# EAGLE design untitled (EAGLE 9.6.2)
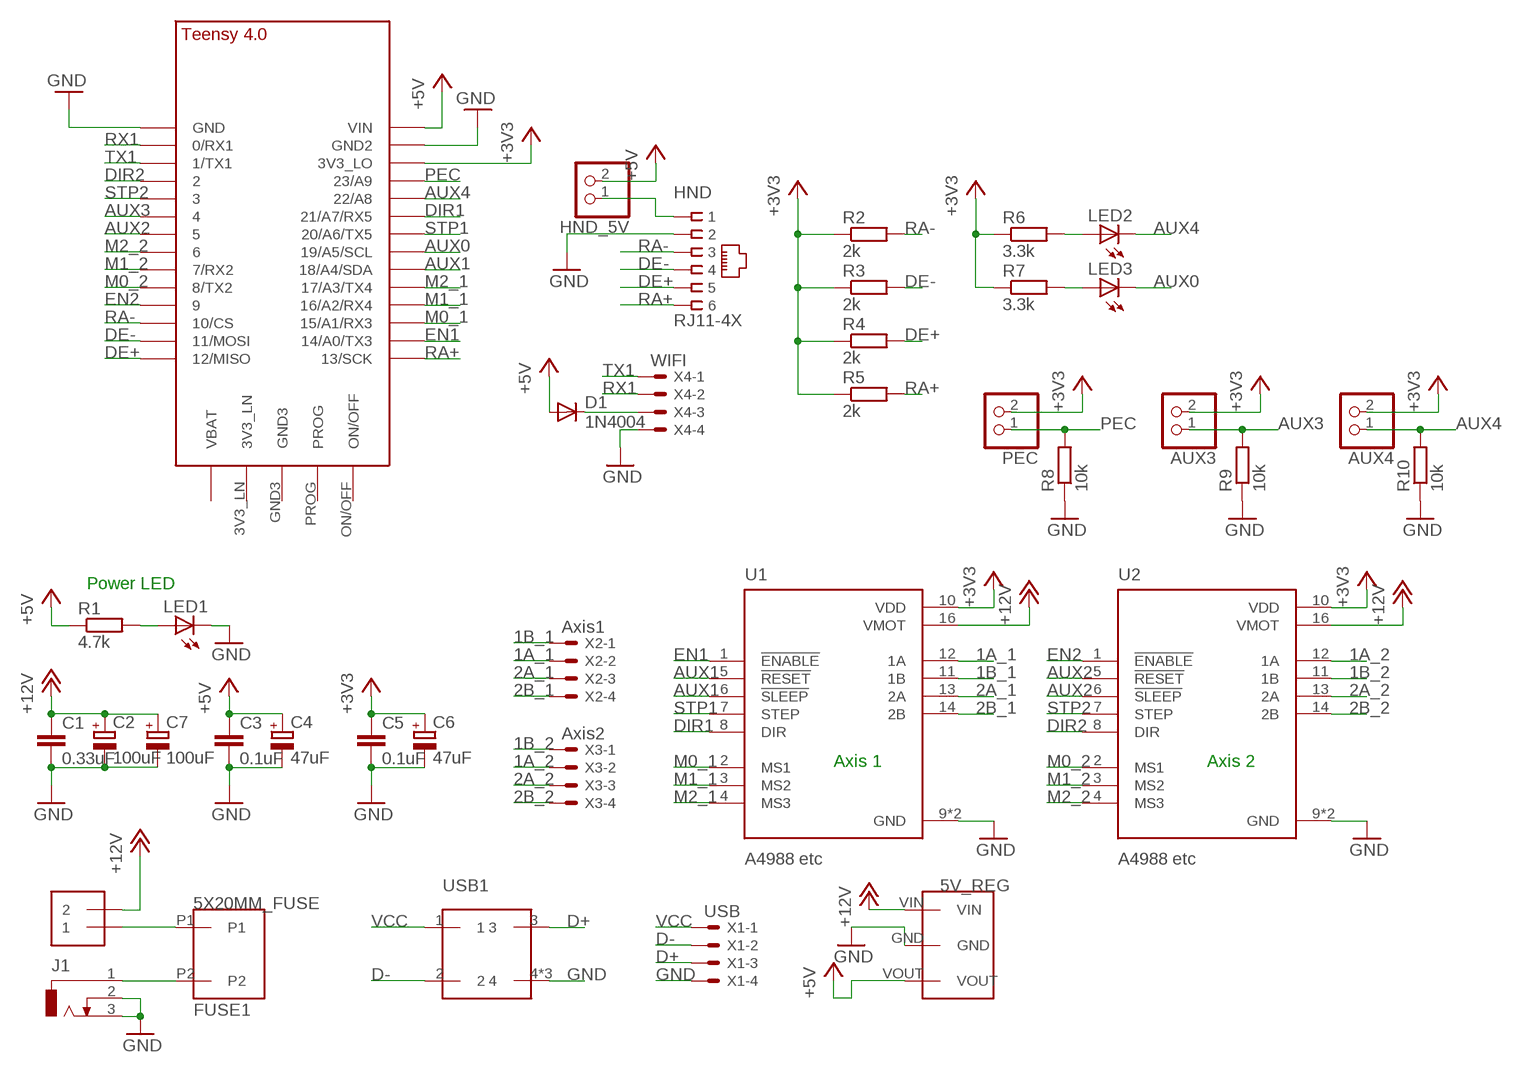
[diagram p0: schematic, sheet 1]

## Parts
5V_REG  TSR_5V  [TSR_5V]
AUX3  PINHD-1X2  [1X02]
AUX4  PINHD-1X2  [1X02]
C1  0.33uF  C-EU050-024X044  [C050-024X044]
C2  100uF  CPOL-EUE5-8.5  [E5-8,5]
C3  0.1uF  C-EU050-024X044  [C050-024X044]
C4  47uF  CPOL-EUE5-8.5  [E5-8,5]
C5  0.1uF  C-EU050-024X044  [C050-024X044]
C6  47uF  CPOL-EUE5-8.5  [E5-8,5]
C7  100uF  CPOL-EUE5-8.5  [E5-8,5]
D1  1N4004  [DO41-10]
FUSE1  5X20MM_FUSE  [5X20MM_FUSE]
HND  RJ11-4X  [RJ11-NO_SHIELD]
HND_5V  PINHD-1X2  [1X02]
J1  DCJ0303  [DCJ0303]
LED1  LED5MM  [LED5MM]
LED2  LED5MM  [LED5MM]
LED3  LED5MM  [LED5MM]
PEC  PINHD-1X2  [1X02]
R1  4.7k  R-EU_0207/7  [0207/7]
R2  2k  R-EU_0207/7  [0207/7]
R3  2k  R-EU_0207/7  [0207/7]
R4  2k  R-EU_0207/7  [0207/7]
R5  2k  R-EU_0207/7  [0207/7]
R6  3.3k  R-EU_0207/7  [0207/7]
R7  3.3k  R-EU_0207/7  [0207/7]
R8  10k  R-EU_0207/7  [0207/7]
R9  10k  R-EU_0207/7  [0207/7]
R10  10k  R-EU_0207/7  [0207/7]
SWITCH  1X2-3.5MM  [1X2-3.5MM]
U1  A4988 etc  A4988_STEPPER_MOTOR_DRIVER_CARRIER  [MODULE_A4988_STEPPER_MOTOR_DRIVER_CARRIER]
U2  A4988 etc  A4988_STEPPER_MOTOR_DRIVER_CARRIER  [MODULE_A4988_STEPPER_MOTOR_DRIVER_CARRIER]
U$1  TEENSY_4.0  [TEENSY_4.0]
USB1  USB-B_SOCKET  [USB-B_SOCKET]
X1  USB  JST-XH-04-PIN-ROUND-PAD  [JST-XH-04-PACKAGE-ROUND-PAD]
X2  Axis1  JST-XH-04-PIN-LONG-PAD  [JST-XH-04-PACKAGE-LONG-PAD]
X3  Axis2  JST-XH-04-PIN-LONG-PAD  [JST-XH-04-PACKAGE-LONG-PAD]
X4  WIFI  JST-XH-04-PIN-LONG-PAD  [JST-XH-04-PACKAGE-LONG-PAD]

## Nets
1A_1: U1.12(1A) X2.2
1A_2: U2.12(1A) X3.2
1B_1: U1.11(1B) X2.1
1B_2: U2.11(1B) X3.1
2A_1: U1.13(2A) X2.3
2A_2: U2.13(2A) X3.3
2B_1: U1.14(2B) X2.4
2B_2: U2.14(2B) X3.4
+3V3: AUX3.2 AUX4.2 C5.1 C6.+ PEC.2 R2.1 R3.1 R4.1 R5.1 R6.1 R7.1 U1.10(VDD) U2.10(VDD) U$1.3V3_LO
+5V: 5V_REG.VOUT C3.1 C4.+ D1.A HND_5V.2 R1.1 U$1.VIN
+12V: 5V_REG.VIN C1.1 C2.+ C7.+ SWITCH.2 U1.16(VMOT) U2.16(VMOT)
AUX0: LED3.K(C) U$1.19/A5/SCL
AUX1: U1.5(!RESET) U1.6(!SLEEP) U$1.18/A4/SDA
AUX2: U2.5(!RESET) U2.6(!SLEEP) U$1.5
AUX3: AUX3.1 R9.2 U$1.4/CANRX
AUX4: AUX4.1 LED2.K(C) R10.2 U$1.22/A8
D+: USB1.3 X1.3
D-: USB1.2 X1.2
DE+: HND.5 R4.2 U$1.12/MISO
DE-: HND.4 R3.2 U$1.11/MOSI
DIR1: U1.8(DIR) U$1.21/A7(21/A7/RX5)
DIR2: U2.8(DIR) U$1.2
EN1: U1.1(!ENABLE) U$1.14/A0(14/A0/TX3)
EN2: U2.1(!ENABLE) U$1.9/CS
GND: 5V_REG.GND C1.2 C2.- C3.2 C4.- C5.2 C6.- C7.- HND.2 J1.2 J1.3 LED1.K(C) R8.1 R9.1 R10.1 U1.9(GND) U1.15(GND) U2.9(GND) U2.15(GND) U$1.GND U$1.GND2 USB1.4 USB1.P$1 USB1.P$2 X1.4 X4.4
M0_1: U1.2(MS1) U$1.15/A1(15/A1/RX3)
M0_2: U2.2(MS1) U$1.8(8/TX2)
M1_1: U1.3(MS2) U$1.16/A2(16/A2/RX4)
M1_2: U2.3(MS2) U$1.7(7/RX2)
M2_1: U1.4(MS3) U$1.17/A3(17/A3/TX4)
M2_2: U2.4(MS3) U$1.6
N$1: FUSE1.P2 J1.1
N$2: FUSE1.P1 SWITCH.1
N$3: LED1.A R1.2
N$4: D1.C X4.3
N$5: HND.1 HND_5V.1
N$7: LED2.A R6.2
N$8: LED3.A R7.2
PEC: PEC.1 R8.2 U$1.23/A9
RA+: HND.6 R5.2 U$1.13/SCK
RA-: HND.3 R2.2 U$1.10/CS
RX1: U$1.0/RX(0/RX1) X4.2
STP1: U1.7(STEP) U$1.20/A6(20/A6/TX5)
STP2: U2.7(STEP) U$1.3/CANTX
TX1: U$1.1/TX(1/TX1) X4.1
VCC: USB1.1 X1.1
Unconnected: U$1.3V3_LN U$1.GND3 U$1.ON/OFF U$1.PROG U$1.VBAT\(VBAT)

## Notes on the sheet
- Power LED
- Axis 1 | Axis 2

## Library data of the parts
5V_REG = alans_lbr:TSR_5V
AUX3 AUX4 HND_5V PEC = pinhead:PINHD-1X2: PIN HEADER
C1 C3 C5 = rcl:C-EU: CAPACITOR, European symbol; SPICEPREFIX: C
C2 C4 C6 C7 = rcl:CPOL-EU: POLARIZED CAPACITOR, European symbol; SPICEPREFIX: C
D1 = adafruit:1N4004: DIODE General purpose 1N400x type rectifier (With bigger pads) http://www.ladyada.net/library/pcb/eaglelibrary.html
FUSE1 = alans_lbr:5X20MM_FUSE
HND = con-tycoelectronics:RJ11: CORCOM Modular RJ Jacks No Shield Source: www.tycoelectronics.com .. ENG_DS_1654001_1099_RJ_L_0507.pdf; MPN: 6609214-3; OC_FARNELL: unknown; OC_NEWARK: 19R7022
J1 = con-jack:DCJ0303: DC POWER JACK Source: DCJ0303.pdf; OC_FARNELL: unknown; OC_NEWARK: unknown
LED1-LED3 = adafruit:LED: LED OSRAM: - CHIPLED LG R971, LG N971, LY N971, LG Q971, LY Q971, LO R971, LY R971 LH N974, LH R974 LS Q976, LO Q976, LY Q976 LO Q996 - Hyper CHIPLED LW Q18S LB Q993, LB Q99A, LB R99A - SideLED LS A670, LO A670, LY A670, LG A670, LP A670 LB A673, LV A673, LT A673, LW A673 LH A674 LY A675 LS A676, LA A676, LO A676, LY A676, LW A676 LS A679, LY A679, LG A679 - Hyper Micro SIDELED® LS Y876, LA Y876, LO Y876, LY Y876 LT Y87S - SmartLED LW L88C, LW L88S LB L89C, LB L89S, LG L890 LS L89K, LO L89K, LY L89K LS L896, LA L896, LO L896, LY L896 - TOPLED LS T670, LO T670, LY T670, LG T670, LP T670 LSG T670, LSP T670, LSY T670, LOP T670, LYG T670 LG T671, LOG T671, LSG T671 LB T673, LV T673, LT T673, LW T673 LH T674 LS T676, LA T676, LO T676, LY T676, LB T676, LH T676, LSB T676, LW T676 LB T67C, LV T67C, LT T67C, LS T67K, LO T67K, LY T67K, LW E67C LS E67B, LA E67B, LO E67B, LY E67B, LB E67C, LV E67C, LT E67C LW T67C LS T679, LY T679, LG T679 LS T770, LO T770, LY T770, LG T770, LP T770 LB T773, LV T773, LT T773, LW T773 LH T774 LS E675, LA E675, LY E675, LS T675 LS T776, LA T776, LO T776, LY T776, LB T776 LHGB T686 LT T68C, LB T68C - Hyper Mini TOPLED® LB M676 - Mini TOPLED Santana® LG M470 LS M47K, LO M47K, LY M47K Source: http://www.osram.convergy.de/
R1-R10 = rcl:R-EU_: RESISTOR, European symbol; SPICEPREFIX: R
SWITCH = adafruit:1X2: 3.5mm Terminal block http://www.ladyada.net/library/pcb/eaglelibrary.html
U1 U2 = A4988_STEPPER_MOTOR_DRIVER_CARRIER:A4988_STEPPER_MOTOR_DRIVER_CARRIER: Stepper motor controler; IC: A4988; 1A; Uin mot: 8÷35V Check availability <https://pricing.snapeda.com/parts/A4988%20STEPPER%20MOTOR%20DRIVER%20CARRIER/Pololu/view-part?ref=eda>; AVAILABILITY: Not in stock; DESCRIPTION: Stepper Motor Driver; MF: Pololu; MP: A4988 STEPPER MOTOR DRIVER CARRIER; PACKAGE: None; PRICE: None
U$1 = TEENSY 4.0:TEENSY_4.0
USB1 = alans_lbr:USB-B_SOCKET
X1-X4 = JST_XH_Connectors:JST-XH-04-PIN: JST XH Connector 2 Pin Wire to board connector. Pitch: 2,54 mm, (0.100") Number of pins: 4 Created by Rembrandt Electronics www.rembrandtelectronics.com

## Board
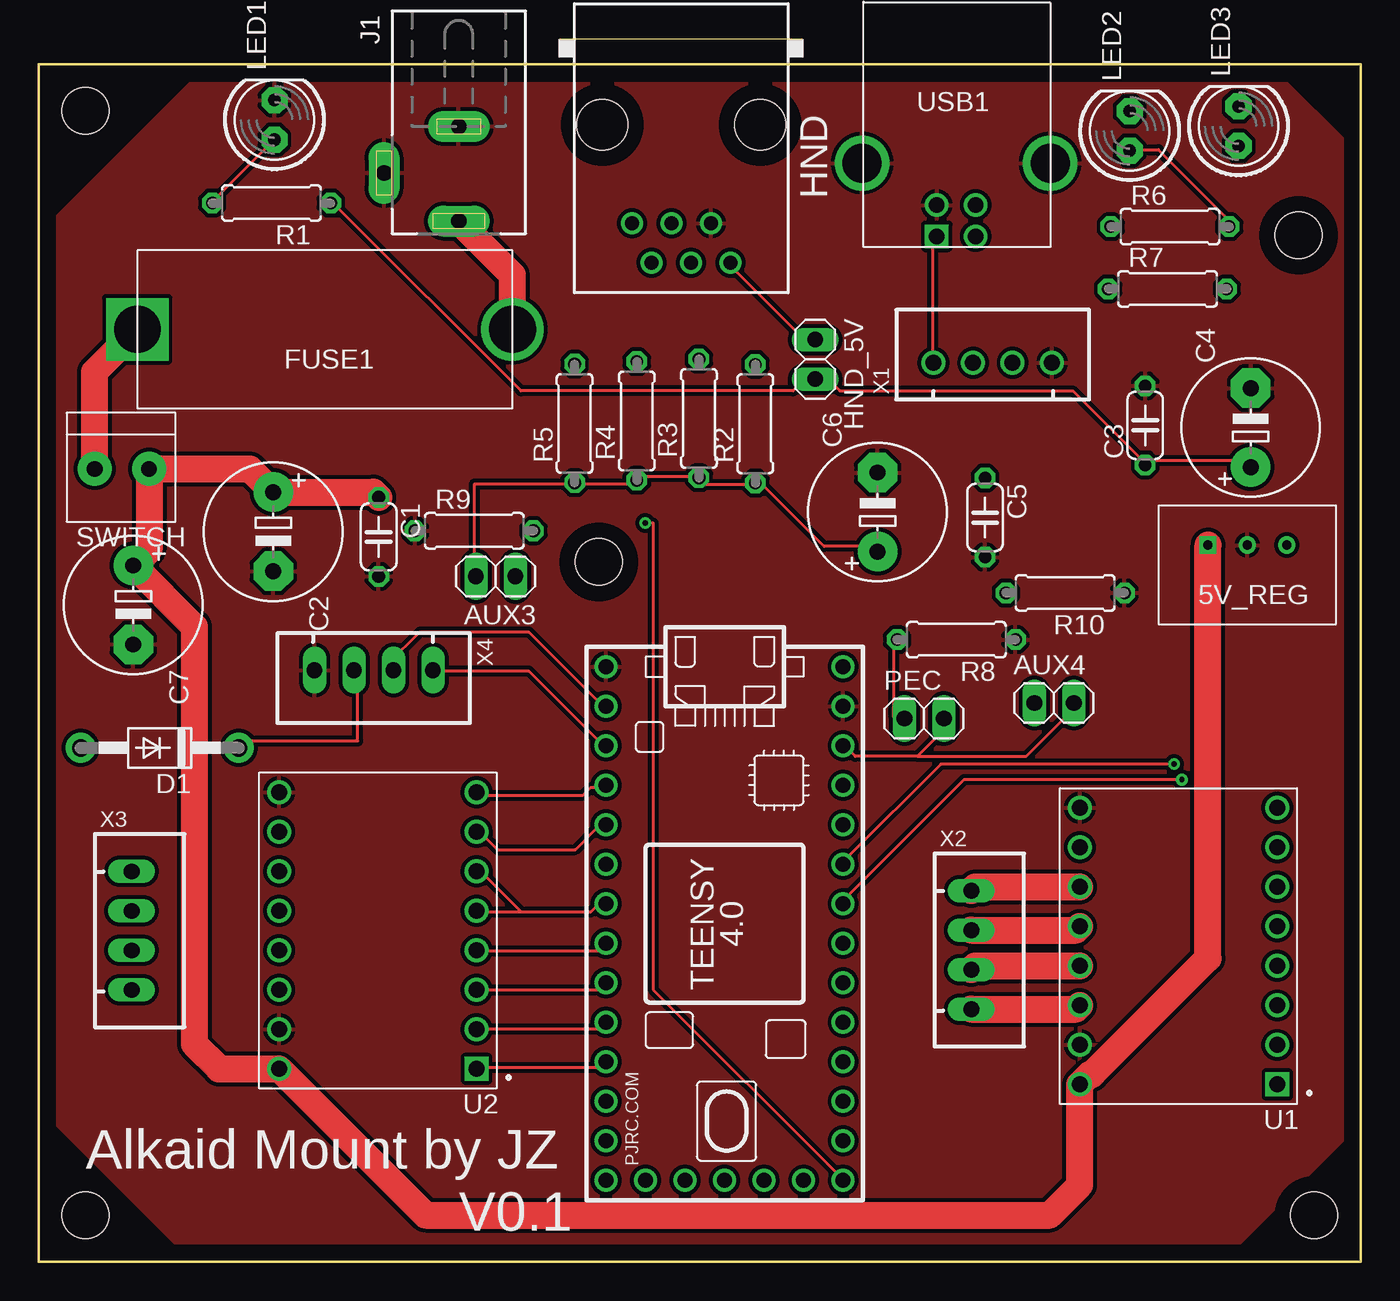
[diagram p1: board, top side]
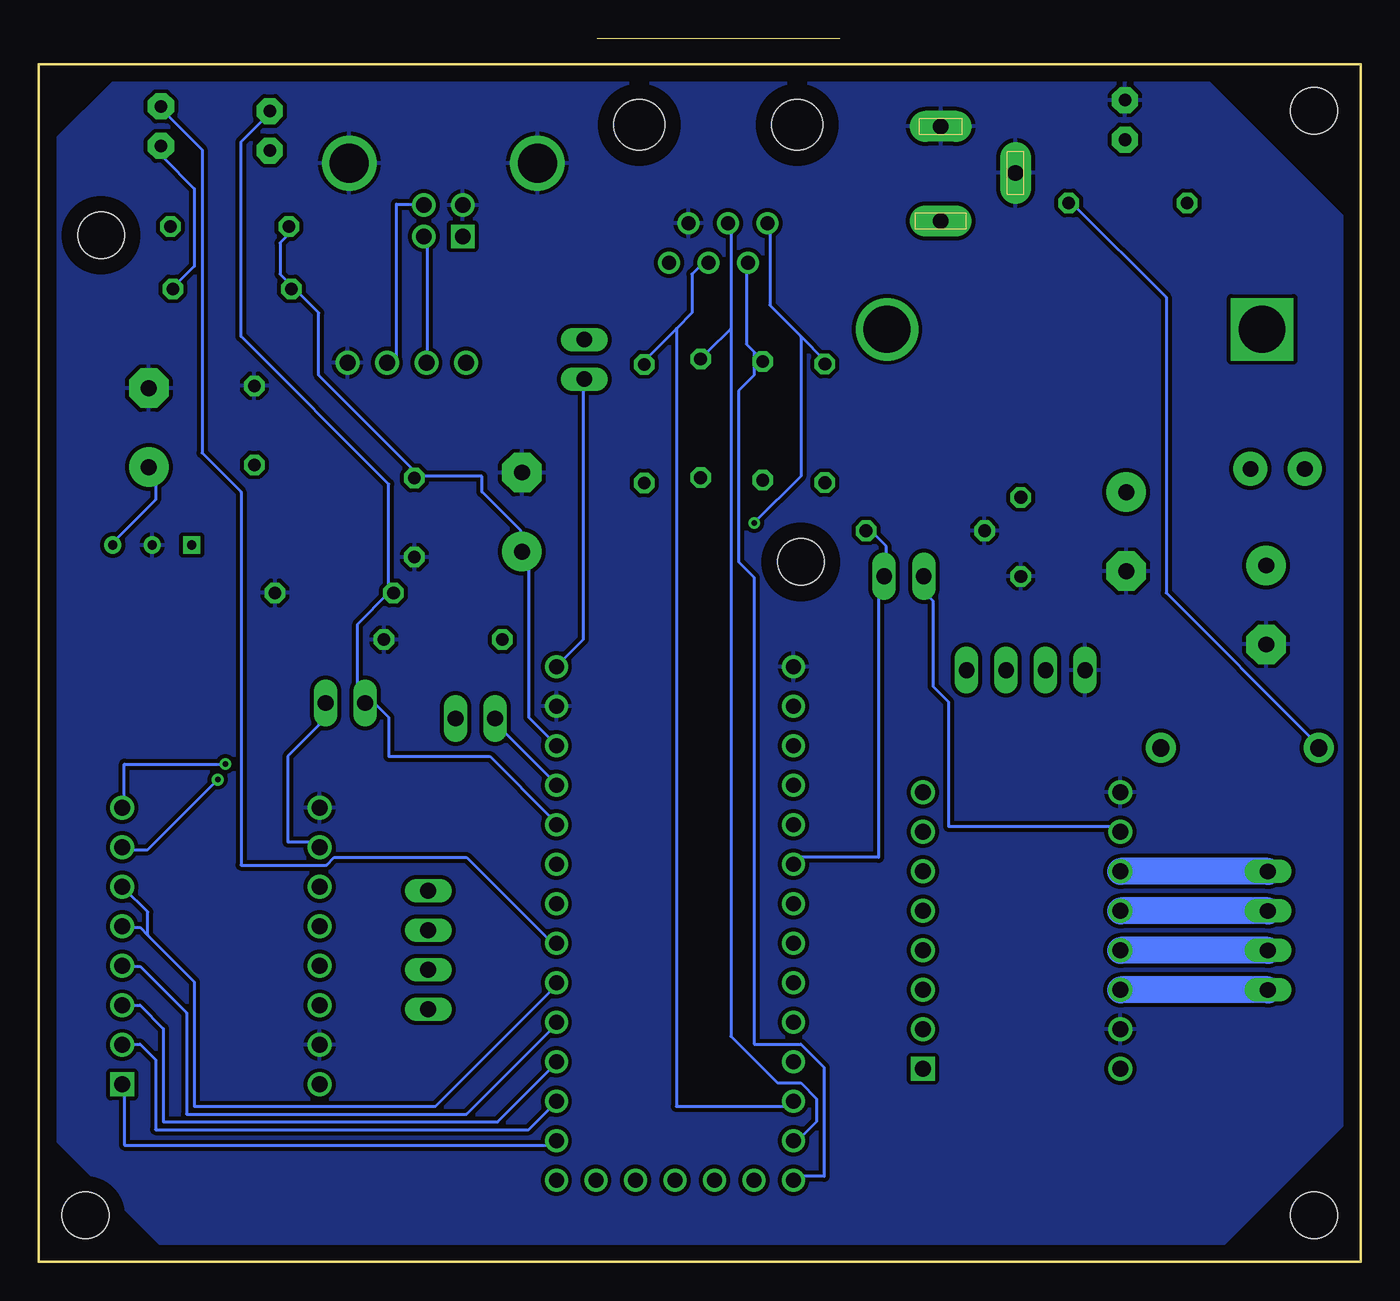
[diagram p2: board, bottom side, seen from below]

Size 85 x 77 mm. Coordinates in mm from the lower left corner, seen from the top.
Outline: 0,0 0,77 85,77 85,0 0,0
Copper layers (1*16): Top 0.035mm / dielectric 1.5mm / Bottom 0.035mm
Design rules "default *": minimum track width 8mil, minimum drill 0.35mm, track to track 10mil, track to pad 10mil, pad to pad 10mil, via to via 10mil, smd to smd 6mil, copper to edge 40mil, drill to drill 6mil, minimum pad ring 10mil, minimum via ring 8mil, stop-mask expansion 4mil, vias tented up to drill 0mil, thermal gap 10mil
Holes 3 mm at 3,3 82,3 81,66 3,74 36,45

### Footprints (pad centres in the part's own frame; a part is rotated, then mirrored left to right if it is on the bottom)
TSR_5V = drill 0.6: GND 5.715,5.08; VOUT 8.255,5.08 | drill 0.6 square: VIN 3.175,5.08
1X02 = drill 1.016 long: 1 -1.27,0; 2 1.27,0
C050-024X044 = drill 0.813 octagon: 1 -2.54,0; 2 2.54,0
E5-8,5 = drill 1.016 pad 2.54: + -2.54,0 | drill 1.016 pad 2.54 octagon: - 2.54,0
DO41-10 = drill 1.118 pad 1.93: A 5.08,0; C -5.08,0
5X20MM_FUSE = drill 3 square: P1 5.08,24.13 | drill 3: P2 5.08,0
RJ11-NO_SHIELD = drill 0.9 pad 1.4: 1 -3.175,8.89; 2 -1.905,6.35; 3 -0.635,8.89; 4 0.635,6.35; 5 1.905,8.89; 6 3.175,6.35 | hole 3.251: -5.08,0; 5.08,0
DCJ0303 = drill 1 pad 2 long: 1 0,3.1; 2 4.8,0; 3 0,-3
LED5MM = drill 0.813 pad 1.676 octagon: A -1.27,0; K 1.27,0
0207/7 = drill 0.813 octagon: 1 -3.81,0; 2 3.81,0
1X2-3.5MM = drill 1 pad 2.184: 1 1.8,0; 2 -1.7,0
MODULE_A4988_STEPPER_MOTOR_DRIVER_CARRIER = drill 1.02 square: 1 -6.35,8.89 | drill 1.02: 2 -6.35,6.35; 3 -6.35,3.81; 4 -6.35,1.27; 5 -6.35,-1.27; 6 -6.35,-3.81; 7 -6.35,-6.35; 8 -6.35,-8.89; 9 6.35,-8.89; 10 6.35,-6.35; 11 6.35,-3.81; 12 6.35,-1.27; 13 6.35,1.27; 14 6.35,3.81; 15 6.35,6.35; 16 6.35,8.89
TEENSY_4.0 = drill 0.965: 0/RX -13.97,-7.62; 1/TX -11.43,-7.62; 2 -8.89,-7.62; 3/CANTX -6.35,-7.62; 3V3_LN 16.51,-2.54; 3V3_LO -11.43,7.62; 4/CANRX -3.81,-7.62; 5 -1.27,-7.62; 6 1.27,-7.62; 7 3.81,-7.62; 8 6.35,-7.62; 9/CS 8.89,-7.62; 10/CS 11.43,-7.62; 11/MOSI 13.97,-7.62; 12/MISO 16.51,-7.62; 13/SCK 16.51,7.62; 14/A0 13.97,7.62; 15/A1 11.43,7.62; 16/A2 8.89,7.62; 17/A3 6.35,7.62; 18/A4/SDA 3.81,7.62; 19/A5/SCL 1.27,7.62; 20/A6 -1.27,7.62; 21/A7 -3.81,7.62; 22/A8 -6.35,7.62; 23/A9 -8.89,7.62; GND -16.51,-7.62; GND2 -13.97,7.62; GND3 16.51,0; ON/OFF 16.51,5.08; PROG 16.51,2.54; VBAT\ 16.51,-5.08; VIN -16.51,7.62
USB-B_SOCKET = drill 1 square: 1 7.3,4.7 | drill 1: 2 4.8,4.7; 3 4.8,2.7; 4 7.3,2.7 | drill 2.5: P$1 0,0; P$2 12.1,0
JST-XH-04-PACKAGE-ROUND-PAD = drill 1.016: 1 -3.81,0; 2 -1.27,0; 3 1.27,0; 4 3.81,0
JST-XH-04-PACKAGE-LONG-PAD = drill 1.016 long: 1 -3.81,0; 2 -1.27,0; 3 1.27,0; 4 3.81,0

### Placement (x,y rotation side)
5V_REG  72,41 0 top
AUX3  29.37,44.07 180 top
AUX4  65.28,35.93 0 top
C1  21.85,46.61 270 top
C2  15.07,46.94 270 top
C3  71.15,53.77 90 top
C4  77.93,53.63 90 top
C5  60.85,47.85 270 top
C6  53.93,48.2 90 top
C7  6.07,42.23 270 top
D1  7.77,33.04 180 top
FUSE1  30.46,54.87 90 top
HND  41.31,73.11 180 top
HND_5V  49.93,58.02 270 top
J1  27,70 180 top
LED1  15.15,73.41 90 top
LED2  70.15,72.71 90 top
LED3  77.15,73.01 90 top
PEC  56.93,34.93 0 top
R1  14.96,68.07 180 top
R2  46.07,53.88 90 top
R3  42.45,54.22 90 top
R4  38.45,54.06 90 top
R5  34.45,53.9 90 top
R6  72.74,66.55 0 top
R7  72.58,62.55 0 top
R8  59,40 180 top
R9  28,47 0 top
R10  66,43 180 top
SWITCH  5.39,50.98 180 top
U1  73.29,20.3 180 top
U2  21.8,21.3 180 top
U$1  44.1,21.75 270 top
USB1  65.04,70.63 180 top
X1  61.34,57.8 0 top
X2  59.96,20.05 270 top
X3  5.96,21.29 270 top
X4  21.53,38.04 180 top

### Tracks (layer width: path | path; a pad name or v marks a point on that pad's centre or on a via)
1A_1
  Top 1.75: X2.2 66.69,21.32 U1.12
1A_2
  Bottom 1.75: X3.2 U2.12
1B_1
  Top 1.75: X2.1 60.21,24.11 U1.11
1B_2
  Bottom 1.75: X3.1 U2.11
2A_1
  Top 1.75: X2.3 60.21,19.03 U1.13
2A_2
  Bottom 1.75: X3.3 U2.13
2B_1
  Top 1.75: X2.4 66.69,16.24 U1.14
2B_2
  Bottom 1.75: X3.4 U2.14
+3V3
  Top 0.203: AUX3.2 28,44.5 28,50 34,50 R5.1 34.5,50 38,50 R4.1 38.5,50.5 42,50.5 R3.1 42.5,50 46,50 R2.1 46.5,50 50.5,46 53.5,46 C6.+ | 56.5,32.5 52.5,32.5 52,33 U$1.3V3_LO | 56.5,32.5 58.5,34.5 PEC.2 | 56.5,32.5 63.5,32.5 66.5,35.5 AUX4.2
  Bottom 0.203: U2.10 15.5,28 26.5,28 26.5,36 27.5,37 27.5,42.5 28,43 28,44 AUX3.2 | U1.10 67,27 69,27 69,32.5 67,34.5 67,35.5 AUX4.2 | R6.1 69,66.5 69,66 69.5,65.5 69.5,63.5 69,63 R7.1 68.5,62.5 67,61 67,57 61,51 61,50.5 C5.1 60.5,50.5 56.5,50.5 56.5,49.5 54,47 54,46 C6.+ 53.5,45.5 53.5,35 52,33.5 U$1.3V3_LO
+5V
  Top 0.203: C4.+ 77.5,51.5 71.5,51.5 C3.1 71,51.5 66.5,56 51.5,56 51,56.5 50,56.5 HND_5V.2 49.5,56.5 49,56.5 48.5,56 31,56 19,68 R1.1
  Bottom 0.203: 5V_REG.VOUT 80,46.5 77.5,49 77.5,51 C4.+ | U$1.VIN 51.5,38.5 50,40 50,56.5 HND_5V.2 | D1.A 3,33.5 12.5,43 12.5,62 18.5,68 R1.1
+12V
  Top 1.75: C1.1 21.52,49.48 C2.+ 13.57,50.98 SWITCH.2 7.09,45.79 C7.+ 10,40.84 10,14 11.59,12.41 U2.16 24.86,3 65,3 66.94,4.94 U1.16 67.59,12.06 67.72,12.06 75.17,19.51 5V_REG.VIN
AUX0
  Bottom 0.203: U$1.19/A5/SCL 52,20.5 57.5,26 66,26 66.5,25.5 72,25.5 72,49.5 74.5,52 74.5,71.5 77,74 LED3.K
AUX1
  Bottom 0.203: 78,21 78.5,21.5 79.5,21.5 U1.5 | 78,21 75,18 75,10 59.5,10 52,17.5 U$1.18/A4/SDA | 78,21 78,22.5 79.5,24 U1.6
AUX2
  Top 0.203: 31,22.5 28.5,22.5 U2.5 | 31,22.5 35.5,22.5 36,23 U$1.5 | 31,22.5 28.5,25 U2.6
AUX3
  Bottom 0.203: R9.2 31.5,47 30.5,46 30.5,44.5 AUX3.1 31,44 31,26 36,26 U$1.4/CANRX
AUX4
  Bottom 0.203: 62.5,43 64.5,41 64.5,37 | 64.5,37 64.5,36 AUX4.1 64.5,37 | 64.5,37 62.5,35 62.5,32.5 56,32.5 52,28.5 U$1.22/A8 | 62.5,43 62.5,50 72,59.5 72,72 70.5,73.5 LED2.K | 62.5,43 R10.2
D+
  Bottom 0.203: USB1.3 60.5,68 62,68 62,58 62.5,57.5 X1.3
D-
  Bottom 0.203: USB1.2 60,65.5 60,58 X1.2
DE+
  Bottom 0.203: 39,58.5 39.5,59 39.5,64 HND.5 | 39,58.5 38.5,58 R4.2 | 39,58.5 39,57 40,56 40,45 39,44 39,14 36,14 34.5,12.5 34.5,5.5 36,5.5 U$1.12/MISO
DE-
  Bottom 0.203: 40.5,60 42,58.5 R3.2 | 40.5,60 40.5,66.5 HND.4 | 40.5,60 40.5,14.5 37.5,11.5 36,11.5 35,10.5 35,9 36,8 U$1.11/MOSI
DIR1  (via drill 0.35)
  Top 0.203: v73,32 58,32 52,26 U$1.21/A7
  Bottom 0.203: v73,32 79.5,32 79.5,29.5 U1.8
DIR2
  Top 0.203: U$1.2 36,30.5 35.5,30.5 35,30 28.5,30 U2.8
EN1
  Bottom 0.203: U$1.14/A0 52,7.5 79.5,7.5 79.5,11 U1.1
EN2
  Top 0.203: U$1.9/CS 36,12.5 28.5,12.5 U2.1
GND
  pour Top: 10,76 1,67 1,9 9,1 75,1 77,1 84,8 84,70 84,72 80,76
  pour Bottom: 10,76 1,67 1,9 9,1 77,1 84,8 84,72 80,76
M0_1
  Bottom 0.203: U$1.15/A1 52,10 53.5,8.5 77.5,8.5 77.5,13 78.5,14 79.5,14 U1.2
M0_2
  Top 0.203: U$1.8 36,15 28.5,15 U2.2
M1_1
  Bottom 0.203: U$1.16/A2 52,12.5 55.5,9 77,9 77,15 78.5,16.5 79.5,16.5 U1.3
M1_2
  Top 0.203: U$1.7 36,17.5 28.5,17.5 U2.3
M2_1
  Bottom 0.203: U$1.17/A3 52,15 57.5,9.5 75.5,9.5 75.5,16 78.5,19 79.5,19 U1.4
M2_2
  Top 0.203: U$1.6 36,20 28.5,20 U2.4
N$1
  Top 1.75: FUSE1.P2 30.46,63.44 J1.1
N$2
  Top 1.75: SWITCH.1 3.59,57.21 FUSE1.P1
N$3
  Top 0.203: R1.2 11.5,68.5 15,72 LED1.A
N$4
  Top 0.203: X4.3 20.5,38 20.5,33.5 13,33.5 D1.C
N$5
  Top 0.203: HND.1 44.5,64 49,59.5 49.5,59.5 HND_5V.1
N$7
  Top 0.203: R6.2 76.5,67 72,71.5 70.5,71.5 LED2.A
N$8
  Bottom 0.203: R7.2 76,63 75,64 75,69 77,71 77,71.5 LED3.A
PEC
  Top 0.203: R8.2 55,40 55,35 55.5,35 PEC.1
  Bottom 0.203: U$1.23/A9 52,31 55.5,34.5 PEC.1
RA+  (via drill 0.35)
  Top 0.203: v39,47.5 39.5,47.5 39.5,17.5 51.5,5.5 U$1.13/SCK
  Bottom 0.203: 36,59.5 38,61.5 38,66.5 HND.6 | 36,59.5 34.5,58 R5.2 | v39,47.5 36,50.5 36,59.5
RA-
  Bottom 0.203: 44,60 43,61 43,63.5 42,64.5 HND.3 | 44,60 46,58 R2.2 | 44,60 44,10 36.5,10 U$1.10/CS
RX1
  Top 0.203: U$1.0/RX 36,36 31.5,40.5 24.5,40.5 22.5,38.5 X4.2
STP1  (via drill 0.35)
  Top 0.203: v73.5,31 59.5,31 52,23.5 U$1.20/A6
  Bottom 0.203: v73.5,31 78,26.5 79.5,26.5 U1.7
STP2
  Top 0.203: U$1.3/CANTX 36,28 34.5,26.5 29.5,26.5 28.5,27.5 U2.7
TX1
  Top 0.203: U$1.1/TX 36,33.5 31.5,38 25.5,38 X4.1
VCC
  Top 0.203: USB1.1 57.5,65.5 57.5,58 X1.1

### Text on the board
tPlace: Alkaid Mount by JZ | V0.1